# Altium schematic sheet rasp_sheild_title.SchDoc
size Tabloid; SheetNumber: 1; SheetTotal: 5; Sheet_Name: Insert name in Document Parameters; Size: 11x17
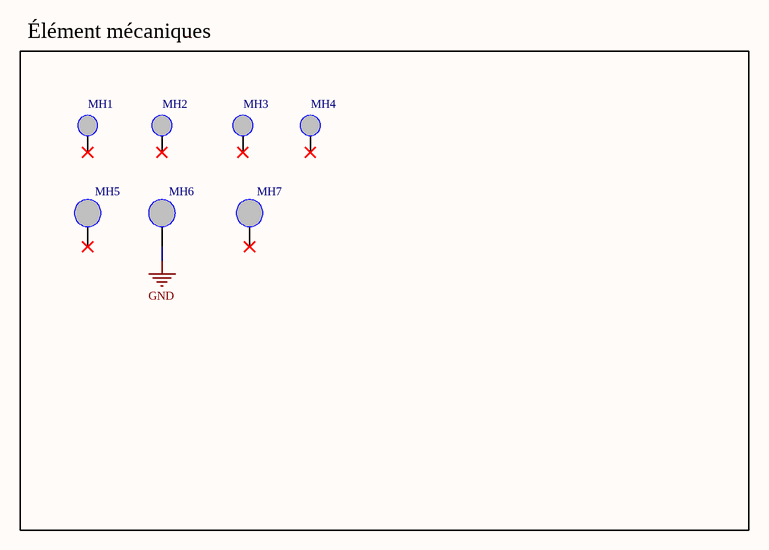
[diagram p0: rasp_sheild_title.SchDoc]

## Parts
MH1  Part Number  [MH2.75mm]  (value not drawn)
MH2  Part Number  [MH2.75mm]  (value not drawn)
MH3  Part Number  [MH2.75mm]  (value not drawn)
MH4  Part Number  [MH2.75mm]  (value not drawn)
MH5  Part Number  [MH3.2mm]  (value not drawn)
MH6  Part Number  [MH3.2mm]  (value not drawn)
MH7  Part Number  [MH3.2mm]  (value not drawn)

## Blocks framed on the sheet
Élément mécaniques: MH1-MH7

## Nets
GND: MH6.1

Not connected (* = marked no-connect by the designer): MH1 1*; MH2 1*; MH3 1*; MH4 1*; MH5 1*; MH7 1*

## Notes on the sheet
- Revision history
- Package size conversion
- Metric
- 1005
- 1608
- Imperial
- 0402
- 0603
- Revision
- 2012
- 3216
- 0805
- 1206
- 3225
- 6432
- 1210
- 2512
- Date :
- Project Title
- Global Project
- Size
- Group
- Date
- Sheet
- of
- Filename
- Designers

## Library data of the parts
MH1-MH4 = MH2.75mm: XXX - Description - Package; GRAMS Lib Spec: 2.7
MH5-MH7 = MH3.2mm: M3 mounting hole; GRAMS Lib Spec: 2.7